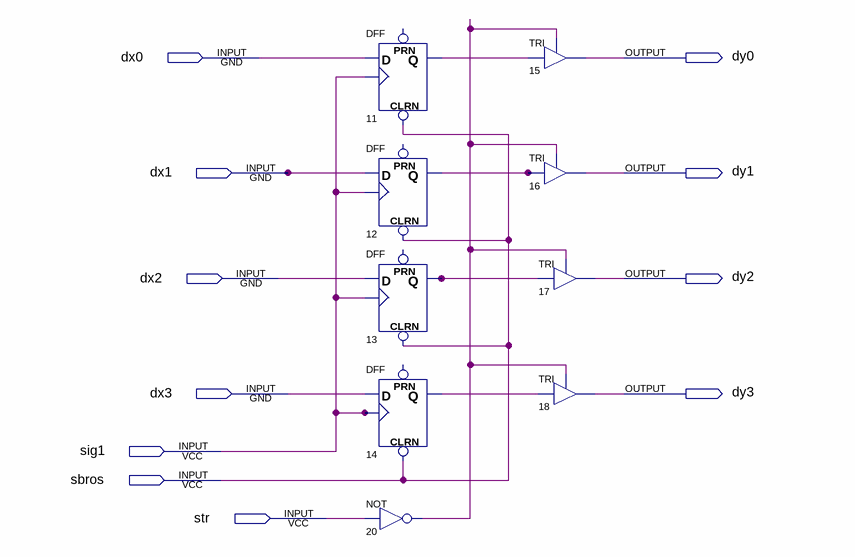
[diagram p0: schematic sheet]
// Quartus schematic reg4k2.bdf as structural Verilog: 9 symbols, 11 pins
module reg4k2 (
  input  dx0,
  input  dx1,
  input  dx2,
  input  dx3,
  input  sig1,
  input  sbros,
  input  str,
  output dy0,
  output dy1,
  output dy2,
  output dy3
);

  wire n11_q, n12_q, n13_q, n14_q, n20_out;

  DFF u_11 (.CLRN(sbros), .CLK(sig1), .D(dx0), .Q(n11_q));  // open: PRN
  DFF u_12 (.CLRN(sbros), .CLK(sig1), .D(dx1), .Q(n12_q));  // open: PRN
  DFF u_13 (.CLRN(sbros), .CLK(sig1), .D(dx2), .Q(n13_q));  // open: PRN
  DFF u_14 (.CLRN(sbros), .CLK(sig1), .D(dx3), .Q(n14_q));  // open: PRN
  not u_20 (n20_out, str);
  TRI u_15 (.IN(n11_q), .OE(n20_out), .OUT(dy0));
  TRI u_16 (.IN(n12_q), .OE(n20_out), .OUT(dy1));
  TRI u_17 (.IN(n13_q), .OE(n20_out), .OUT(dy2));
  TRI u_18 (.IN(n14_q), .OE(n20_out), .OUT(dy3));
endmodule
